# EAGLE schematic Circuit_Schematic (EAGLE 8.0.0)
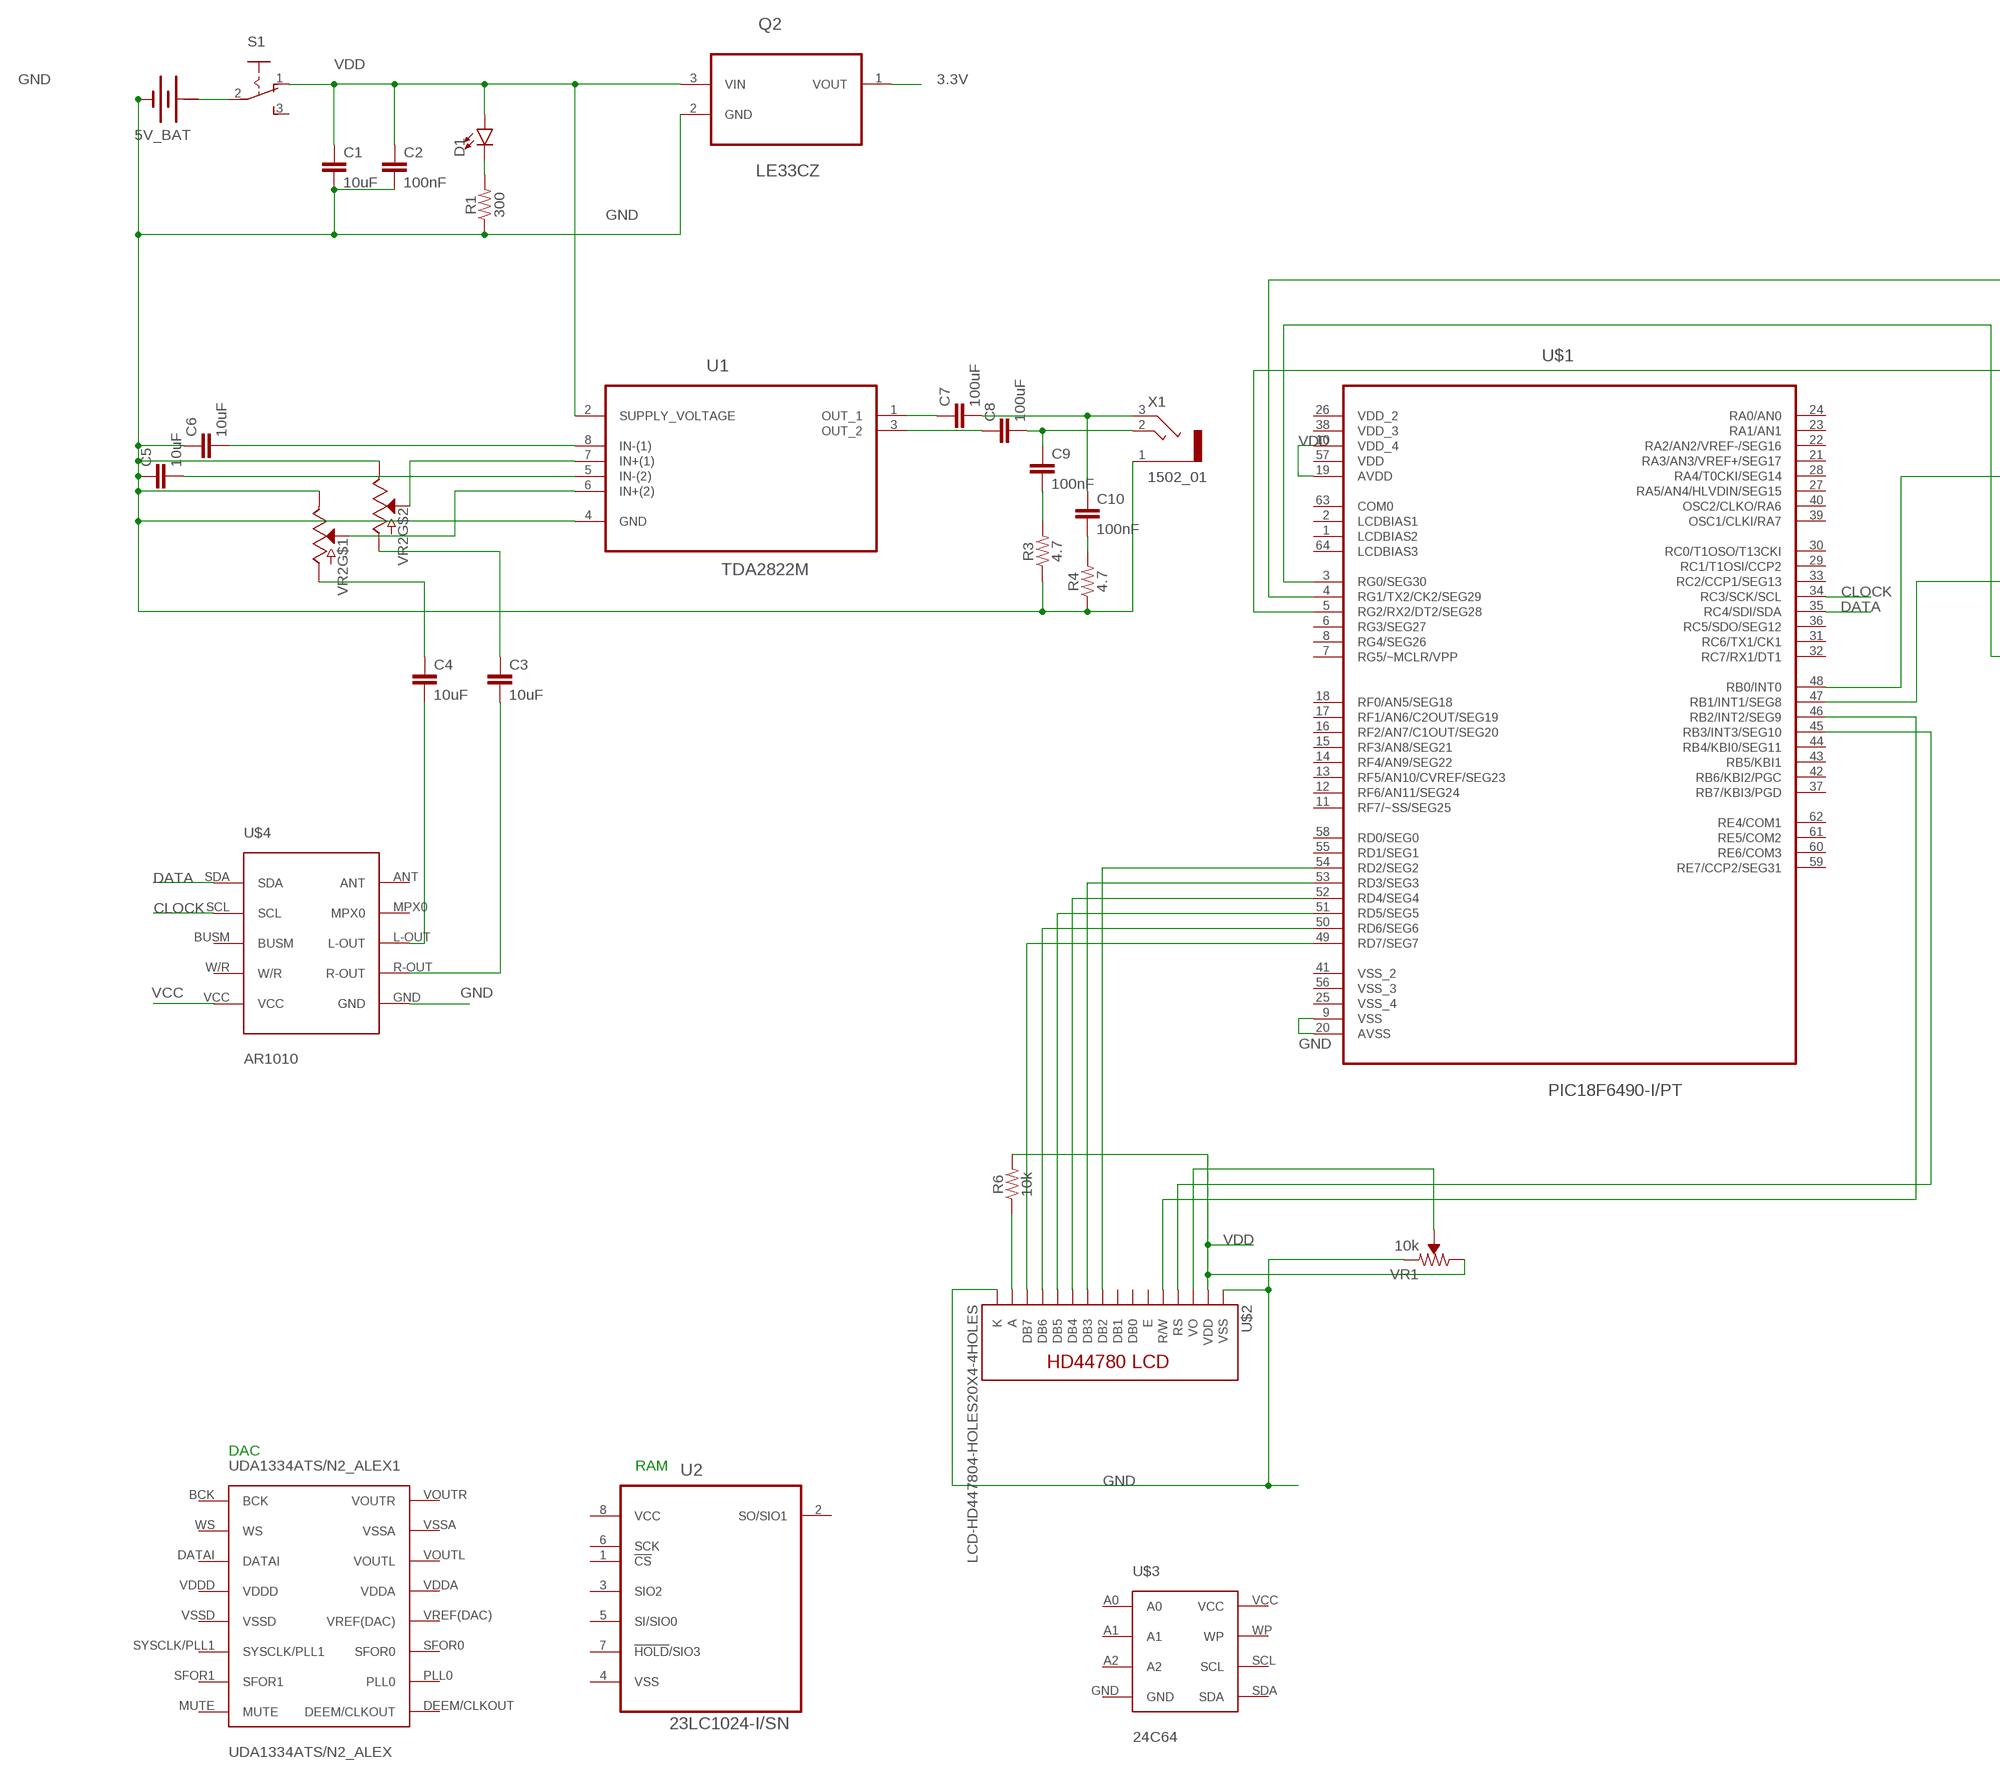
[diagram p0: schematic, sheet 1, part 1 of 2]
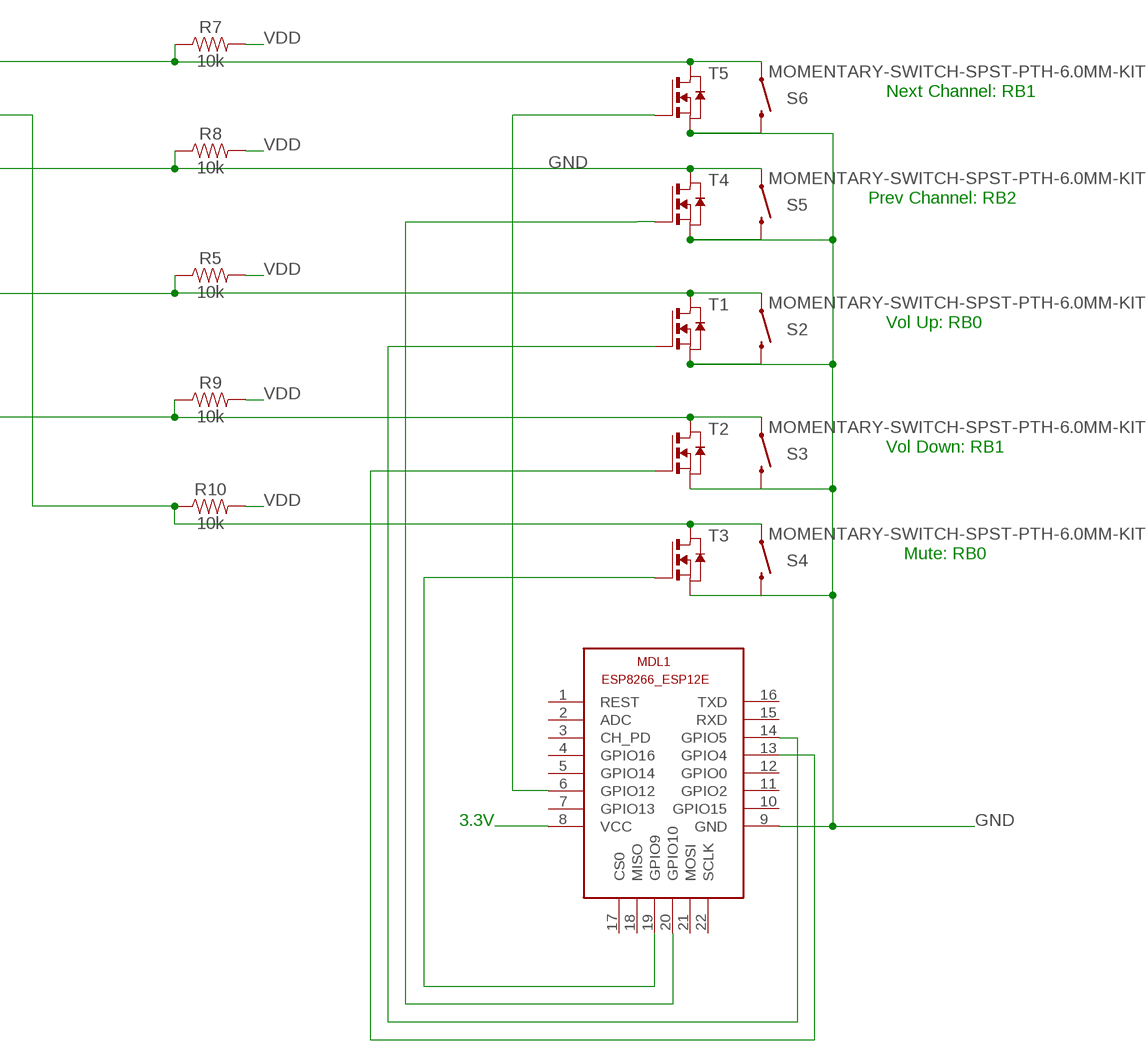
[diagram p1: schematic, sheet 1, part 2 of 2]

## Parts
5V_BAT  BATTERY  [BATTERY]
C1  10uF  10UF-1210-50V-20%  [1210]
C2  100nF  10UF-1210-50V-20%  [1210]
C3  10uF  10UF-1210-50V-20%  [1210]
C4  10uF  10UF-1210-50V-20%  [1210]
C5  10uF  10UF-1210-50V-20%  [1210]
C6  10uF  10UF-1210-50V-20%  [1210]
C7  100uF  10UF-1210-50V-20%  [1210]
C8  100uF  10UF-1210-50V-20%  [1210]
C9  100nF  10UF-1210-50V-20%  [1210]
C10  100nF  10UF-1210-50V-20%  [1210]
D1  LED10MM  [LED_10MM]
MDL1  ESP8266-12EESP8266-ESP12E  [ESP8266-ESP12E]
Q2  LE33CZ  [TO127P254X749-3]
R1  300  1OHM-0603-1/10W-1%  [0603]
R3  4.7  1OHM-0603-1/10W-1%  [0603]
R4  4.7  1OHM-0603-1/10W-1%  [0603]
R5  10k  10KOHM-0603-1/10W-1%  [0603]
R6  10k  10KOHM-0603-1/10W-1%  [0603]
R7  10k  10KOHM-0603-1/10W-1%  [0603]
R8  10k  10KOHM-0603-1/10W-1%  [0603]
R9  10k  10KOHM-0603-1/10W-1%  [0603]
R10  10k  10KOHM-0603-1/10W-1%  [0603]
S1  255SB  [255SB]
S2  MOMENTARY-SWITCH-SPST-PTH-6.0MM-KIT  [TACTILE_SWITCH_PTH_6.0MM_KIT]
S3  MOMENTARY-SWITCH-SPST-PTH-6.0MM-KIT  [TACTILE_SWITCH_PTH_6.0MM_KIT]
S4  MOMENTARY-SWITCH-SPST-PTH-6.0MM-KIT  [TACTILE_SWITCH_PTH_6.0MM_KIT]
S5  MOMENTARY-SWITCH-SPST-PTH-6.0MM-KIT  [TACTILE_SWITCH_PTH_6.0MM_KIT]
S6  MOMENTARY-SWITCH-SPST-PTH-6.0MM-KIT  [TACTILE_SWITCH_PTH_6.0MM_KIT]
T1  NMOSSOT223  [SOT223]
T2  NMOSSOT223  [SOT223]
T3  NMOSSOT223  [SOT223]
T4  NMOSSOT223  [SOT223]
T5  NMOSSOT223  [SOT223]
U1  TDA2822M  [DIP254P762X508-8]
U2  23LC1024-I/SN  [SOIC127P600X175-8N]
U$1  PIC18F6490-I/PT  [QFP50P1200X1200X120-64N]
U$2  LCD-HD447804-HOLES20X4-4HOLES  [LCD-20X4-4HOLES]
U$3  24C64  [SOIC-8]
U$4  AR1010  [AR1010]
UDA1334ATS/N2_ALEX1  UDA1334ATS/N2_ALEX  [UDA1334ATS/N2_ALEX]
VR1  10k  TRIMPOT-SMD-3MM-OPEN-1/10W-25%  [TRIMPOT-SMD-TC33X]
VR2  POTENTIOMETER_DUAL-PTH-12MM-1/20W-20%  [POT-DUAL-PTH-PANASONIC-VERT]
X1  1502_01  [1502_01]

## Nets
3.3V: MDL1.8(VCC) Q2.1(VOUT)
CLOCK: U$1.34(RC3/SCK/SCL) U$4.SCL
DATA: U$1.35(RC4/SDI/SDA) U$4.SDA
GND: 5V_BAT.- C1.2 C2.2 C5.1 C6.1 MDL1.9(GND) Q2.2(GND) R1.1 R3.1 R4.1 S2.3 S3.3 S4.3 S5.3 S6.3 T1.3(S) T2.3(S) T3.3(S) T4.3(S) T5.3(S) U1.4(GND) U$1.9(VSS) U$1.20(AVSS) U$2.P$1(VSS) U$2.P$16(K) U$4.GND VR1.3(CCW) VR2.A1(E) VR2.B1(E) X1.1
N$1: C5.2 U1.5(IN-(2))
N$3: R7.1 S6.1 T5.2(D) T5.4(D) U$1.4(RG1/TX2/CK2/SEG29)
N$4: U1.7(IN+(1)) VR2.B2(S)
N$5: U1.6(IN+(2)) VR2.A2(S)
N$6: C10.2 R4.2
N$7: C7.1 U1.1(OUT_1)
N$8: R5.1 S2.1 T1.2(D) T1.4(D) U$1.48(RB0/INT0)
N$9: C6.2 U1.8(IN-(1))
N$10: C4.2 U$4.L-OUT
N$11: C4.1 VR2.A3(A)
N$12: C3.1 VR2.B3(A)
N$13: C3.2 U$4.R-OUT
N$14: C7.2 C10.1 X1.3
N$15: C8.1 U1.3(OUT_2)
N$16: C8.2 C9.1 X1.2
N$17: C9.2 R3.2
N$18: D1.C R1.2
N$19: R9.1 S3.1 T2.2(D) T2.4(D) U$1.47(RB1/INT1/SEG8)
N$20: 5V_BAT.+ S1.2(P)
N$22: MDL1.14(GPIO5) T1.1(G)
N$23: MDL1.13(GPIO4) T2.1(G)
N$26: MDL1.19(GPIO9) T3.1(G)
N$27: R6.1 U$2.P$15(A)
N$28: MDL1.20(GPIO10) T4.1(G)
N$29: U$1.46(RB2/INT2/SEG9) U$2.P$5(R/W)
N$30: U$1.45(RB3/INT3/SEG10) U$2.P$4(RS)
N$31: U$2.P$3(VO) VR1.2(WIPER)
N$32: MDL1.6(GPIO12) T5.1(G)
N$33: R10.1 S4.1 T3.2(D) T3.4(D) U$1.3(RG0/SEG30)
RD2: U$1.54(RD2/SEG2) U$2.P$9(DB2)
RD3: U$1.53(RD3/SEG3) U$2.P$10(DB3)
RD4: U$1.52(RD4/SEG4) U$2.P$11(DB4)
RD5: U$1.51(RD5/SEG5) U$2.P$12(DB5)
RD6: U$1.50(RD6/SEG6) U$2.P$13(DB6)
RD7: U$1.49(RD7/SEG7) U$2.P$14(DB7)
VCC: U$4.VCC
VDD: C1.1 C2.1 D1.A Q2.3(VIN) R5.2 R6.2 R7.2 R8.1 R8.2 R9.2 R10.2 S1.1(O) S5.1 T4.2(D) T4.4(D) U1.2(SUPPLY_VOLTAGE) U$1.5(RG2/RX2/DT2/SEG28) U$1.10(VDD_4) U$1.19(AVDD) U$2.P$2(VDD) VR1.1(CW)
Unconnected: MDL1.1(REST) MDL1.2(ADC) MDL1.3(CH_PD) MDL1.4(GPIO16) MDL1.5(GPIO14) MDL1.7(GPIO13) MDL1.10(GPIO15) MDL1.11(GPIO2) MDL1.12(GPIO0) MDL1.15(RXD) MDL1.16(TXD) MDL1.17(CS0) MDL1.18(MISO) MDL1.21(MOSI) MDL1.22(SCLK) S1.3(S) U2.1(!CS) U2.2(SO/SIO1) U2.3(SIO2) U2.4(VSS) U2.5(SI/SIO0) U2.6(SCK) U2.7(!HOLD!/SIO3) U$1.1(LCDBIAS2) U$1.2(LCDBIAS1) U$1.6(RG3/SEG27) U$1.7(RG5/~MCLR/VPP) U$1.8(RG4/SEG26) U$1.11(RF7/~SS/SEG25) U$1.12(RF6/AN11/SEG24) U$1.13(RF5/AN10/CVREF/SEG23) U$1.14(RF4/AN9/SEG22) U$1.15(RF3/AN8/SEG21) U$1.16(RF2/AN7/C1OUT/SEG20) U$1.17(RF1/AN6/C2OUT/SEG19) U$1.18(RF0/AN5/SEG18) U$1.21(RA3/AN3/VREF+/SEG17) U$1.22(RA2/AN2/VREF-/SEG16) U$1.23(RA1/AN1) U$1.24(RA0/AN0) U$1.27(RA5/AN4/HLVDIN/SEG15) U$1.28(RA4/T0CKI/SEG14) U$1.29(RC1/T1OSI/CCP2) U$1.30(RC0/T1OSO/T13CKI) U$1.31(RC6/TX1/CK1) U$1.32(RC7/RX1/DT1) U$1.33(RC2/CCP1/SEG13) U$1.36(RC5/SDO/SEG12) U$1.37(RB7/KBI3/PGD) U$1.39(OSC1/CLKI/RA7) U$1.40(OSC2/CLKO/RA6) U$1.42(RB6/KBI2/PGC) U$1.43(RB5/KBI1) U$1.44(RB4/KBI0/SEG11) U$1.55(RD1/SEG1) U$1.58(RD0/SEG0) U$1.59(RE7/CCP2/SEG31) U$1.60(RE6/COM3) U$1.61(RE5/COM2) U$1.62(RE4/COM1) U$1.63(COM0) U$1.64(LCDBIAS3) U$2.P$6(E) U$2.P$7(DB0) U$2.P$8(DB1) U$3.A0 U$3.A1 U$3.A2 U$3.GND U$3.SCL U$3.SDA U$3.VCC U$3.WP U$4.ANT U$4.BUSM U$4.MPX0 U$4.W/R UDA1334ATS/N2_ALEX1.BCK UDA1334ATS/N2_ALEX1.DATAI UDA1334ATS/N2_ALEX1.DEEM/CLKOUT UDA1334ATS/N2_ALEX1.MUTE UDA1334ATS/N2_ALEX1.PLL0 UDA1334ATS/N2_ALEX1.SFOR0 UDA1334ATS/N2_ALEX1.SFOR1 UDA1334ATS/N2_ALEX1.SYSCLK/PLL1 UDA1334ATS/N2_ALEX1.VDDA UDA1334ATS/N2_ALEX1.VDDD UDA1334ATS/N2_ALEX1.VOUTL UDA1334ATS/N2_ALEX1.VOUTR UDA1334ATS/N2_ALEX1.VREF(DAC) UDA1334ATS/N2_ALEX1.VSSA UDA1334ATS/N2_ALEX1.VSSD UDA1334ATS/N2_ALEX1.WS

## Notes on the sheet
- Next Channel: RB1
- Prev Channel: RB2
- Vol Up: RB0
- Vol Down: RB1
- Mute: RB0
- 3.3V
- DAC
- RAM

## Power pins joined to a net without a drawn wire
+: 5V_BAT.+@1(+)
VCC: U2.8(VCC)
VDD: U$1.57(VDD)
VDD_2: U$1.26(VDD_2)
VDD_3: U$1.38(VDD_3)
VSS_2: U$1.41(VSS_2)
VSS_3: U$1.56(VSS_3)
VSS_4: U$1.25(VSS_4)

## Library data of the parts
5V_BAT = special:BATTERY: BATTERY
C1 C3-C6 = SparkFun-Capacitors:10UF: 10.0µF ceramic capacitors A capacitor is a passive two-terminal electrical component used to store electrical energy temporarily in an electric field.; PROD_ID: CAP-09824
C2 C7-C10 = SparkFun-Capacitors:10UF: 10.0µF ceramic capacitors A capacitor is a passive two-terminal electrical component used to store electrical energy temporarily in an electric field.; PROD_ID: CAP-09824; VALUE: 10uF
D1 = SparkFun-LED:LED: LED (Generic) Standard schematic elements and footprints for 5mm, 3mm, 1206, and 0603 sized LEDs. Generic LEDs with no color specified.
MDL1 = ESP8266-12E:ESP8266-12E: ESP8266-12E with additional I/O and GPIO04/05 corrected The author cannot warrant that this library is free from error or will meet your specific requirements. Created by PuceBaboon.com. Komagane, Nagano, JAPAN
Q2 = ST Microelctronics_By_element14_Batch_1:LE33CZ: VOLTAGE REGULATORS; MPN: LE33CZ; OC_FARNELL: 9755349; OC_NEWARK: 26M0166; PACKAGE: TO-92; SUPPLIER: STMICROELECTRONICS
R1 R3 R4 = SparkFun-Resistors:1OHM: 1Ω resistor A resistor is a passive two-terminal electrical component that implements electrical resistance as a circuit element. Resistors act to reduce current flow, and, at the same time, act to lower voltage levels within circuits. - Wikipedia; PROD_ID: RES-08269; VALUE: 1
R5-R10 = SparkFun-Resistors:10KOHM: 10kΩ resistor A resistor is a passive two-terminal electrical component that implements electrical resistance as a circuit element. Resistors act to reduce current flow, and, at the same time, act to lower voltage levels within circuits. - Wikipedia; PROD_ID: RES-00824
S1 = switch:255SB: SLIDING SWITCH Distributor Buerklin, 11G810
S2-S6 = SparkFun-Switches:MOMENTARY-SWITCH-SPST: Momentary Switch (Pushbutton) - SPST Normally-open (NO) SPST momentary switches (buttons, pushbuttons). Variants PTH-12MM - 12mm square, through-hole Momentary Pushbutton Switch - 12mm Square <https://www.sparkfun.com/products/9190> (COM-09190) PTH-6.0MM, PTH-6.0MM-KIT - 6.0mm square, through-hole Mini Pushbutton Switch <https://www.sparkfun.com/products/97> (COM-00097) KIT package intended for soldering kit's - only one side of pads' copper is exposed. PTH-RIGHT-ANGLE-KIT - Right-angle, through-hole Right Angle Tactile Button <https://www.sparkfun.com/products/10791> - Used on SparkFun BigTime Watch Kit <https://www.sparkfun.com/products/11734> SMD-12MM - 12mm square, surface-mount Tactile Button - SMD (12mm) <https://www.sparkfun.com/products/12993> (COM-12993) Used on SparkFun PicoBoard <https://www.sparkfun.com/products/11888> SMD-4.5MM - 4.5mm Square Trackball Switch Used on SparkFun Blackberry Trackballer Breakout <https://www.sparkfun.com/products/13169> SMD-4.6MMX2.8MM - 4.60mm x 2.80mm, surface mount Used on SparkFun SAMD21 Mini Breakout <https://www.sparkfun.com/products/13664> SMD-5.2MM, SMD-5.2-REDUNDANT - 5.2mm square, surface-mount Mini Pushbutton Switch - SMD <https://www.sparkfun.com/products/8720> (COM-08720) Used on Arduino Pro Mini <https://www.sparkfun.com/products/11114> REDUNDANT package connects both switch circuits together SMD-6.0X3.5MM - 6.0 x 3.5mm, surface mount Momentary Reset Switch SMD <https://www.sparkfun.com/products/8229> (COM-08229) SMD-6.2MM-TALL - 6.2mm square, surface mount Tactile Button - SMD (6mm) <https://www.sparkfun.com/products/12992> Used on SparkFun Digital Sandbox <https://www.sparkfun.com/products/12651> SMD-RIGHT-ANGLE - Right-angle, surface mount Used on SparkFun Block for Intel® Edison - Arduino <https://www.sparkfun.com/products/13036>; PROD_ID: SWCH-08441; SF_SKU: COM-00097
T1-T5 = zetex:NMOSSOT223: MOS FET; OC_FARNELL: unknown; OC_NEWARK: unknown
U1 = ST Microelctronics_By_element14_Batch_1:TDA2822M: POWER AMPLIFIER; MPN: TDA2822M; OC_FARNELL: 1218171; OC_NEWARK: 89K1049; PACKAGE: PDIP; SUPPLIER: STMICROELECTRONICS
U2 = microchip_fromOneCall:23LC1024-I/SN: 1Mbit SPI Serial SRAM,SOIC-8; MPN: 23LC1024-I/SN; OC_FARNELL: 2212150; OC_NEWARK: 94T8231; PACKAGE: SOIC-8; SUPPLIER: MICROCHIP
U$1 = Microchip_By_element14_Batch_1:PIC18F6490-I/PT: IC PIC MCU; MPN: PIC18F6490-I/PT; OC_FARNELL: 1332278; OC_NEWARK: 08J9646; PACKAGE: QFP-64; SUPPLIER: Microchip
U$2 = HD44780LCD:LCD-HD44780
U$3 = MIRO:24C64
U$4 = MIRO:AR1010
UDA1334ATS/N2_ALEX1 = UDA1334ATS_ALEX:UDA1334ATS/N2_ALEX
VR1 = SparkFun-Resistors:TRIMPOT: Trimming Potentiometer (Trimpot) Three-terminal potentiometers, with an adjustable wiper and two adjustable resistors. A pot can be used to create a configurable voltage divider, or as a variable resistor. "Trimpots" are a subset of potentiometers, usually intended for "set-and-forget" applications. They're often more delicate than standard potentiometers - rated for fewer turns. Variants PTH-KNOB - PTH Trimpot w/ finger-adjustable knob Trimpot 10K with Knob <https://www.sparkfun.com/products/9806> (COM-09806) Datasheet <http://www.sparkfun.com/datasheets/Components/General/TSR-3386.pdf> SMD-3MM-CLOSED-FRAME - SMD 3mm Square Closed-Frame Trimpot Used on e.g. EasyDriver - Stepper Motor Driver <https://www.sparkfun.com/products/12779> Datasheet <http://www.bitechnologies.com/pdfs/22.pdf> (22AR10KTR) SMD-5MM - SMD 5mm Square Closed-Frame Trimpot Used on e.g. IOIO-OTG - V2.2 <https://www.sparkfun.com/products/13613> Datasheet <http://www.vishay.com/docs/51008/ts53.pdf> (TS53YL502MR10) SMD-3MM-1/10W-25% - 3mm Square Open-Frame Trimpot Used on e.g. SparkFun Shapeoko <https://www.sparkfun.com/products/13899> Datasheet <http://www.bourns.com/docs/Product-Datasheets/TC33.pdf> (TC33X-2-103E); PROD_ID: RES-12428
VR2 = SparkFun-Resistors:POTENTIOMETER_DUAL: Potentiometer (Pot) Dual-Gang Three-terminal potentiometers, with an adjustable wiper and two adjustable resistors. A pot can be used to create a configurable voltage divider, or as a variable resistor. This is a dua-gang pot - it includes two separate circuits, both controlled by one wiper. Variants PTH-12MM and PTH-12MM-KIT - 12mm Square, PTH Vertical Pots Used on the SparkFun SparkPunk Sound Kit <https://www.sparkfun.com/products/11177> (filter control) The KIT variant exposes copper on only one side of the PTH pad, so the part can only be assembled on one side of the PCB. Useful for beginner soldering kits.; PROD_ID: RES-11897
X1 = con-lumberg:1502_01: Jack connectors according to JISC 6560, 3.5 mm Klinkensteckverbinder nach JISC 6560, 3,5 mm Source: http://www.lumberg.com/Produkte/PDFs/1502_01.pdf; OC_FARNELL: 4739747; OC_NEWARK: unknown